# EAGLE design N64A_FA_E7x (EAGLE 7.7.0)
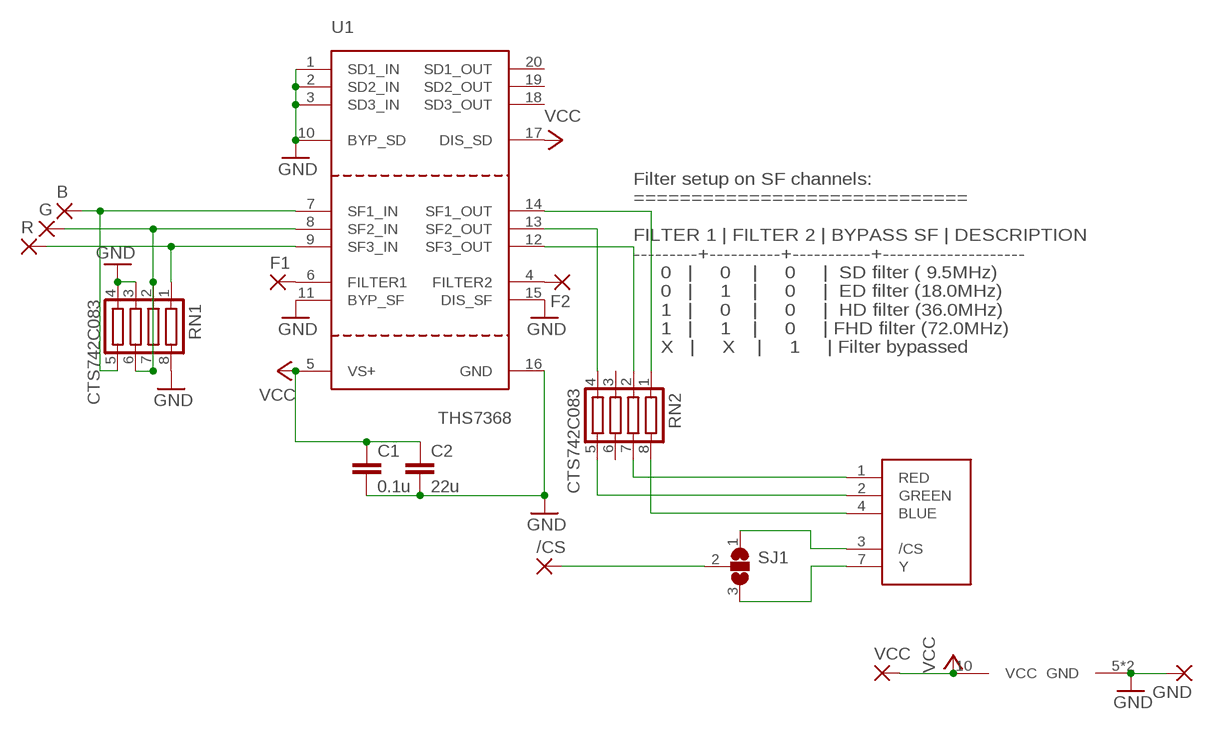
[diagram p0: schematic, sheet 1]

## Parts
/CS  SMD2  [SMD1,27-2,54]
B  SMD2  [SMD1,27-2,54]
C1  0.1u  C-EUC0603  [C0603]
C2  22u  C-EUC1206  [C1206]
F1  SMD1  [SMD0,8-1,6]
F2  SMD1  [SMD0,8-1,6]
G  SMD2  [SMD1,27-2,54]
GND  SMD2  [SMD1,27-2,54]
R  SMD2  [SMD1,27-2,54]
RN1  CTS742C083  [CTS742C083]
RN2  CTS742C083  [CTS742C083]
SJ1  SJ2W  [SJ_2]
U1  THS7368  [THS7368]
U$1  SNES_MULTIAV_RGBSY  [SNES_MULTIAV_RGBSY]
VCC  SMD2  [SMD1,27-2,54]

## Nets
GND: C1.2 C2.2 GND.1(P) RN1.3 RN1.4 RN1.8 U1.1(SD1_IN) U1.2(SD2_IN) U1.3(SD3_IN) U1.10(BYP_SD) U1.11(BYP_SF) U1.15(DIS_SF) U1.16(GND) U$1.5(GND) U$1.6(GND)
N$1: RN2.7 U$1.1(RED)
N$2: RN2.8 U$1.4(BLUE)
N$3: RN2.5 U$1.2(GREEN)
N$4: RN2.4 U1.13(SF2_OUT)
N$5: RN2.1 U1.14(SF1_OUT)
N$6: RN2.2 U1.12(SF3_OUT)
N$7: SJ1.1 U$1.3(/CS)
N$8: F1.P$1(P) U1.6(FILTER1)
N$9: R.1(P) RN1.1 U1.9(SF3_IN)
N$10: G.1(P) RN1.2 RN1.6 RN1.7 U1.8(SF2_IN)
N$11: F2.P$1(P) U1.4(FILTER2)
N$12: /CS.1(P) SJ1.2
N$13: B.1(P) RN1.5 U1.7(SF1_IN)
N$14: SJ1.3 U$1.7(Y)
VCC: C1.1 C2.1 U1.5(VS+) U1.17(DIS_SD) U$1.10(VCC) VCC.1(P)
Unconnected: RN2.3 RN2.6 U1.18(SD3_OUT) U1.19(SD2_OUT) U1.20(SD1_OUT)

## Library data of the parts
/CS B G GND R VCC = wirepad:SMD2: SMD PAD
C1 C2 = rcl:C-EU: CAPACITOR, European symbol
F1 F2 = wirepad:SMD1
RN1 RN2 = resistor-net:CTS742C083: Chip Resistor Array 4 Single Resistor Source: http://www.ctscorp.com/components/Datasheets/CTSChipArrayDs.pdf; OC_FARNELL: unknown; OC_NEWARK: unknown
SJ1 = jumper:SJ2W: SMD solder JUMPER
U1 = snes_div:THS7368
U$1 = snes_div:SNES_MULTIAV_RGBSY

## Board
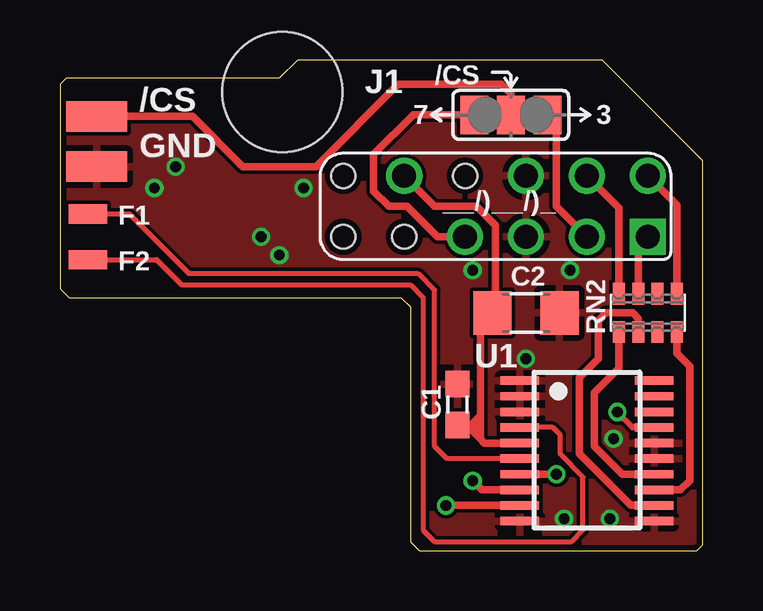
[diagram p1: board, top side]
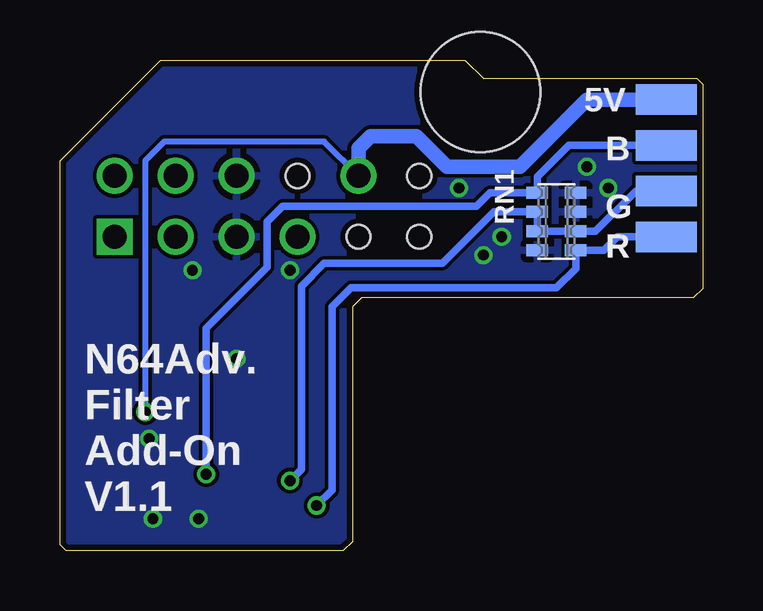
[diagram p2: board, bottom side, seen from below]

Size 26.8 x 20.45 mm. Coordinates in mm from the lower left corner, seen from the top.
Outline: 14.22,10.54 14.61,10.16 14.61,0.38 14.99,0 26.54,0 26.8,0.25 26.8,16.26 22.61,20.45 9.91,20.45 9.14,19.69 0.25,19.69 0,19.43 0,10.92 0.38,10.54 14.22,10.54
Copper layers (1*16): Top 0.035mm / dielectric 1.5mm / Bottom 0.035mm
Design rules "ITEADstudio_DRC": minimum track width 6mil, minimum drill 12mil, track to track 6mil, track to pad 6mil, pad to pad 6mil, via to via 6mil, smd to smd 0mil, copper to edge 10mil, drill to drill 10mil, minimum pad ring 10mil, minimum via ring 6mil, stop-mask expansion 2mil, vias tented up to drill 30mil, thermal gap 10mil
Holes 5 mm at 9.27,19.12

### Footprints (pad centres in the part's own frame; a part is rotated, then mirrored left to right if it is on the bottom)
SMD1,27-2,54 = smd 1.27 x 2.54: 1 0,0
C0603 = smd 1.1 x 1: 1 -0.85,0; 2 0.85,0
C1206 = smd 1.6 x 1.8: 1 -1.4,0; 2 1.4,0
SMD0,8-1,6 = smd 0.8 x 1.6: P$1 0,0
CTS742C083 = smd 0.5 x 0.9: 1 -1.2,-0.8; 2 -0.4,-0.8; 3 0.4,-0.8; 4 1.2,-0.8; 5 1.2,0.8; 6 0.4,0.8; 7 -0.4,0.8; 8 -1.2,0.8
SJ_2 = smd 1.168 x 1.6: 1 -1.524,0; 2 0,0; 3 1.524,0
THS7368 = smd 1.6 x 0.35: 1 -2.8,2.895; 2 -2.8,2.245; 3 -2.8,1.595; 4 -2.8,0.945; 5 -2.8,0.295; 6 -2.8,-0.355; 7 -2.8,-1.005; 8 -2.8,-1.655; 9 -2.8,-2.305; 10 -2.8,-2.955; 11 2.8,-2.955; 12 2.8,-2.305; 13 2.8,-1.655; 14 2.8,-1.005; 15 2.8,-0.355; 16 2.8,0.295; 17 2.8,0.945; 18 2.8,1.595; 19 2.8,2.245; 20 2.8,2.895
SNES_MULTIAV_RGBSY = drill 1 square: 1 6.35,-1.27 | drill 1: 2 6.35,1.27; 3 3.81,-1.27; 4 3.81,1.27; 5 1.27,-1.27; 6 1.27,1.27; 7 -1.27,-1.27; 10 -3.81,1.27 | hole 1: -3.81,-1.27; -6.35,-1.27; -6.35,1.27; -1.27,1.27

### Placement (x,y rotation side)
/CS  1.52,18.1 270 top
B  1.52,16.89 270 bottom
C1  16.57,6.1 90 top
C2  19.43,9.91 0 top
F1  1.17,14.03 270 top
F2  1.17,12.13 270 top
G  1.52,14.99 270 bottom
GND  1.52,16 270 top
R  1.52,13.08 270 bottom
RN1  6.1,13.72 90 bottom
RN2  24.51,9.91 0 top
SJ1  18.8,18.16 180 top
U1  21.97,4.19 0 top
U$1  18.16,14.35 0 top
VCC  1.52,18.8 90 bottom

### Tracks (layer width: path | path; a pad name or v marks a point on that pad's centre or on a via)
GND  (via drill 0.45)
  other vias: 3.94,15.11 8.38,13.08 21.02,1.33 17.21,11.68 19.43,8 22.92,1.33 23.08,4.67 10.16,15.11 21.27,11.68 4.83,16 9.14,12.32
  pour Top: -0.25,20.7 27.69,20.7 27.69,-0.89 -0.25,-0.89
  pour Bottom: -0.25,20.7 27.69,20.7 27.69,-0.89 -0.25,-0.89
N$1
  Top 0.305: RN2.7 24.11,12.68 U$1.1
N$2
  Top 0.305: RN2.8 23.31,14.28 U$1.4
N$3
  Top 0.305: RN2.5 25.71,14.35 | 25.71,14.35 25.71,14.42 | 25.71,14.35 25.71,14.42 | 25.71,14.42 U$1.2
N$4
  Top 0.305: U1.13 25.87,2.54 26.26,2.92 26.26,7.68 25.71,8.23 RN2.4
N$5
  Top 0.305: U1.14 23.45,3.19 22.29,4.35 22.29,6.57 23.31,7.59 RN2.1
N$6
  Top 0.305: RN2.2 24.11,9.67 23.88,9.91 22.76,9.91 22.45,9.59 22.45,8 21.65,7.21 21.65,4.03 23.8,1.89 U1.12
N$7
  Top 0.305: U$1.3 20.7,14.35 20.7,17.78 SJ1.1
N$8
  Top 0.203: F1.P$1 2.89,14.03 5.37,11.56 14.92,11.56 15.62,10.86 15.62,4.35 16.13,3.84 U1.6
N$9  (via drill 0.45)
  Top 0.305: U1.9 v16.1,1.89
  Bottom 0.305: R.1 3.56,13.08 4.12,12.52 RN1.1 5.3,11.75 6.1,10.95 14.67,10.95 15.46,10.16 15.46,2.52 v16.1,1.89
N$10  (via drill 0.45)
  Top 0.305: U1.8 17.59,2.54 v17.21,2.92
  Bottom 0.305: v17.21,2.92 16.73,3.4 16.73,11.02 15.78,11.97 10.86,11.97 8.71,14.12 RN1.6 RN1.7 RN1.2 4.46,13.32 2.79,14.99 G.1
N$11
  Top 0.203: F2.P$1 4.03,12.13 5.08,11.08 14.61,11.08 15.14,10.54 15.14,0.86 15.62,0.38 21.34,0.38 21.81,0.86 21.81,3.08 20.86,4.03 20.86,4.83 20.54,5.14 U1.4
N$12
  Top 0.305: SJ1.2 18.8,19.05 18.41,19.43 14.1,19.43 10.67,16 7.62,16 5.53,18.1 /CS.1
N$13  (via drill 0.45)
  Top 0.305: U1.7 v20.7,3.19
  Bottom 0.305: v20.7,3.19 20.7,9.27 18.16,11.81 18.16,13.72 17.53,14.35 9.43,14.35 8.87,14.92 RN1.5 6.9,15.58 5.59,16.89 B.1
N$14
  Top 0.305: SJ1.3 14.73,18.16 13.08,16.51 13.08,14.99 13.72,14.35 14.48,14.35 15.75,13.08 U$1.7
VCC  (via drill 0.45)
  Top 0.254: 24.76,5.14 U1.17 23.88,5.14 v23.24,5.78
  Top 0.305: U$1.10 15.62,14.35 17.37,14.35 18.16,13.56 18.16,10.04 | 18,9.91 17.53,9.43 17.53,5.62 | 17.05,5.14 17.45,5.54 | 17.45,5.54 17.53,5.62 | U1.5 17.71,4.49 17.49,4.7 | 17.27,4.93 17.49,4.7 | 17.27,4.93 17.13,5.06 | 17.13,5.06 17.05,5.14 | C1.1 16.95,5.25 17.05,5.14 | 17.53,5.62 17.53,4.73 17.49,4.7 | 17.45,5.54 17.45,5.11 17.4,5.06 | 17.4,5.06 17.27,4.93 | 17.13,5.06 17.4,5.06
  Top 0.356: 18.16,10.04 C2.1 18,9.91
  Bottom 0.254: U$1.10 15.78,17.05 22.45,17.05 23.24,16.26 v23.24,5.78
  Bottom 0.61: VCC.1 4.83,18.8 7.62,16 10.67,16 11.94,17.27 13.84,17.27 14.35,16.76 U$1.10

### Text on the board
tPlace: __/)__/)_
tNames: J1 | /CS | /CS | 7 | 3 | GND | F1 | F2 | C2 | RN2 | U1 | C1
bNames: 5V | B | G | RN1 | R | N64Adv. / Filter / Add-On / V1.1